# Altium schematic sheet ASBB_ServoIn.SchDoc
size A4
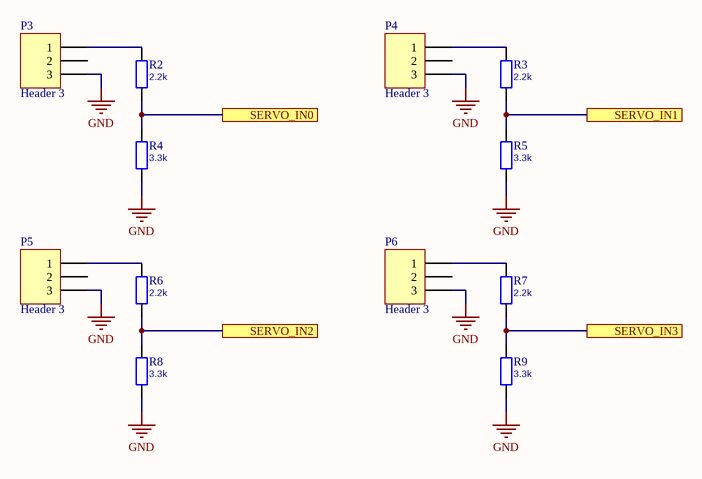
[diagram p0: ASBB_ServoIn.SchDoc]

## Parts
P3  Header 3  [HDR1X3]
P4  Header 3  [HDR1X3]
P5  Header 3  [HDR1X3]
P6  Header 3  [HDR1X3]
R2  2.2k  [0603]
R3  2.2k  [0603]
R4  3.3k  [0603]
R5  3.3k  [0603]
R6  2.2k  [0603]
R7  2.2k  [0603]
R8  3.3k  [0603]
R9  3.3k  [0603]

## Ports
SERVO_IN0, SERVO_IN1, SERVO_IN2, SERVO_IN3

## Nets
GND: P3.3 P4.3 P5.3 P6.3 R4.1 R5.1 R8.1 R9.1
SERVO_IN0: R2.1 R4.2 ; port SERVO_IN0
SERVO_IN1: R3.1 R5.2 ; port SERVO_IN1
SERVO_IN2: R6.1 R8.2 ; port SERVO_IN2
SERVO_IN3: R7.1 R9.2 ; port SERVO_IN3
NetP3_1: P3.1 R2.2
NetP4_1: P4.1 R3.2
NetP5_1: P5.1 R6.2
NetP6_1: P6.1 R7.2

Not connected (* = marked no-connect by the designer): P3 2; P4 2; P5 2; P6 2

## Library data of the parts
P3-P6 = Header 3: Header, 3-Pin; LatestRevisionDate: 17-Jul-2002; LatestRevisionNote: Re-released for DXP Platform.; Publisher: Altium Limited
R2-R9 = Resistor: Partnumber: ?; Value: ?